# Altium project 06D_dualDesign.PrjPcb
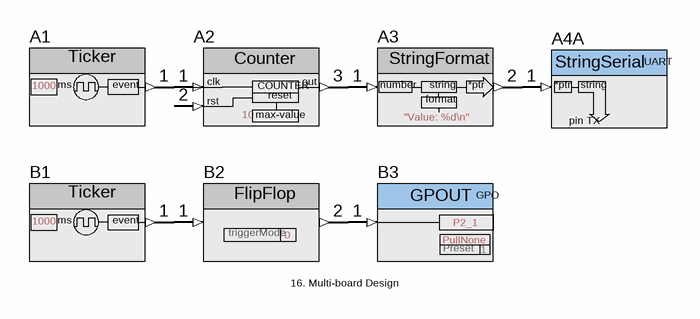
[diagram p0: 06D_dualDesign.SchDoc]
OrderQty: 8; prj: 06D_dualDesign
1 sheet, 7 parts. Net scope: hierarchical (ports join the sheet entries above them; power ports are global).
Board file: 06D_dualDesign.PcbDoc

## Sheet 06D_dualDesign.SchDoc
size A4

### Parts
A1  Ticker  nBlocksParameter1: 1000
A2  Counter  nBlocksParameter1: 10
A3  StringFormat  nBlocksParameter1: "Value: %d\n"
A4  StringSerial  (part A of 2)
B1  Ticker  nBlocksParameter1: 1000
B2  FlipFlop  Parameter 1: triggerMode  nBlocksParameter1: 0
B3  GPOUT  nBlocksParameter1: P2_1  Parameter 3: Preset  nBlocksParameter3: 1  nBlocksParameter2: PullNone

### Nets
NetA1_1: A1.1(OUT) A2.1(COUNT-IN)
NetA2_3: A2.3(OUT) A3.1(IN)
NetA3_2: A3.2(OUT) A4.1(TX)
NetB1_1: B1.1(OUT) B2.1(IN)
NetB2_2: B2.2 B3.1(IN)

Not connected (* = marked no-connect by the designer): A2 2(RESET)

### Notes on the sheet
- 16. Multi-board Design
- (in symbol NODE-COUNTER) clk; out; COUNTER; rst; reset; max-value
- (in symbol NODE-GPOUT) GPO
- (in symbol NODE-STRINGFORMAT) number; string; *ptr; format
- (in symbol NODE-STRINGSERIAL-split, part A) UART; *ptr; string; pin TX
- (in symbol NODE-TICKER) ms; event

### Library data of the parts
A1 B1 = NODE-TICKER: Creates a Periodical Event; ComponentLink1Description: link; ComponentLink1URL: https://github.com/nBlocksStudioNodes/nblocks_ticker
A2 = NODE-COUNTER: Ressetable Counter. Returns to zero, when max-value is reached; Parameter 1: AutoResetValue; ComponentLink1Description: link; ComponentLink1URL: https://github.com/nBlocksStudioNodes/nblocks_counter
A3 = NODE-STRINGFORMAT: Parameter 1: formatString; ComponentLink1Description: link; ComponentLink1URL: https://github.com/nBlocksStudioNodes/nblocks_stringformat
A4 = NODE-STRINGSERIAL-split: nBlocksParameter2: USBRX; Parameter 2: pinRX; nBlocksParameter1: USBTX; Parameter 1: pinTX; ComponentLink1Description: link; ComponentLink1URL: https://github.com/nBlocksStudioNodes/nblocks_stringserial
B2 = NODE-FLIPFLOP: [0] for (triggerMode_Positive) when the received value is > 0,        [1] for ( triggerMode_Zero), will toggle when received value = 0,  [2] for ( triggerMode_Both) it will toggle on any value; ComponentLink1Description: link; ComponentLink1URL: https://github.com/nBlocksStudioNodes/nblocks_flipflop
B3 = NODE-GPOUT: General Purpose Mcroprocessor Output, set modeString as: PullUp, PullDown, PullNone, OpenDrain; Parameter 1: pinOut; ComponentLink1Description: link; ComponentLink1URL: https://github.com/nBlocksStudioNodes/nblocks_gpout; Parameter 2: modeString